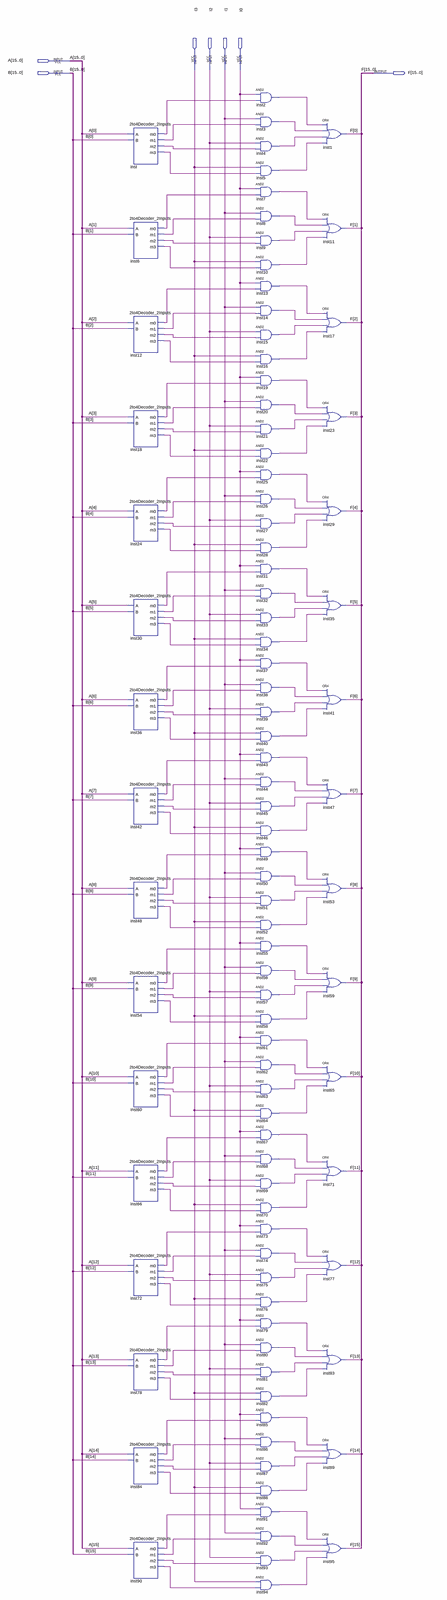
[diagram p0: schematic sheet, whole]
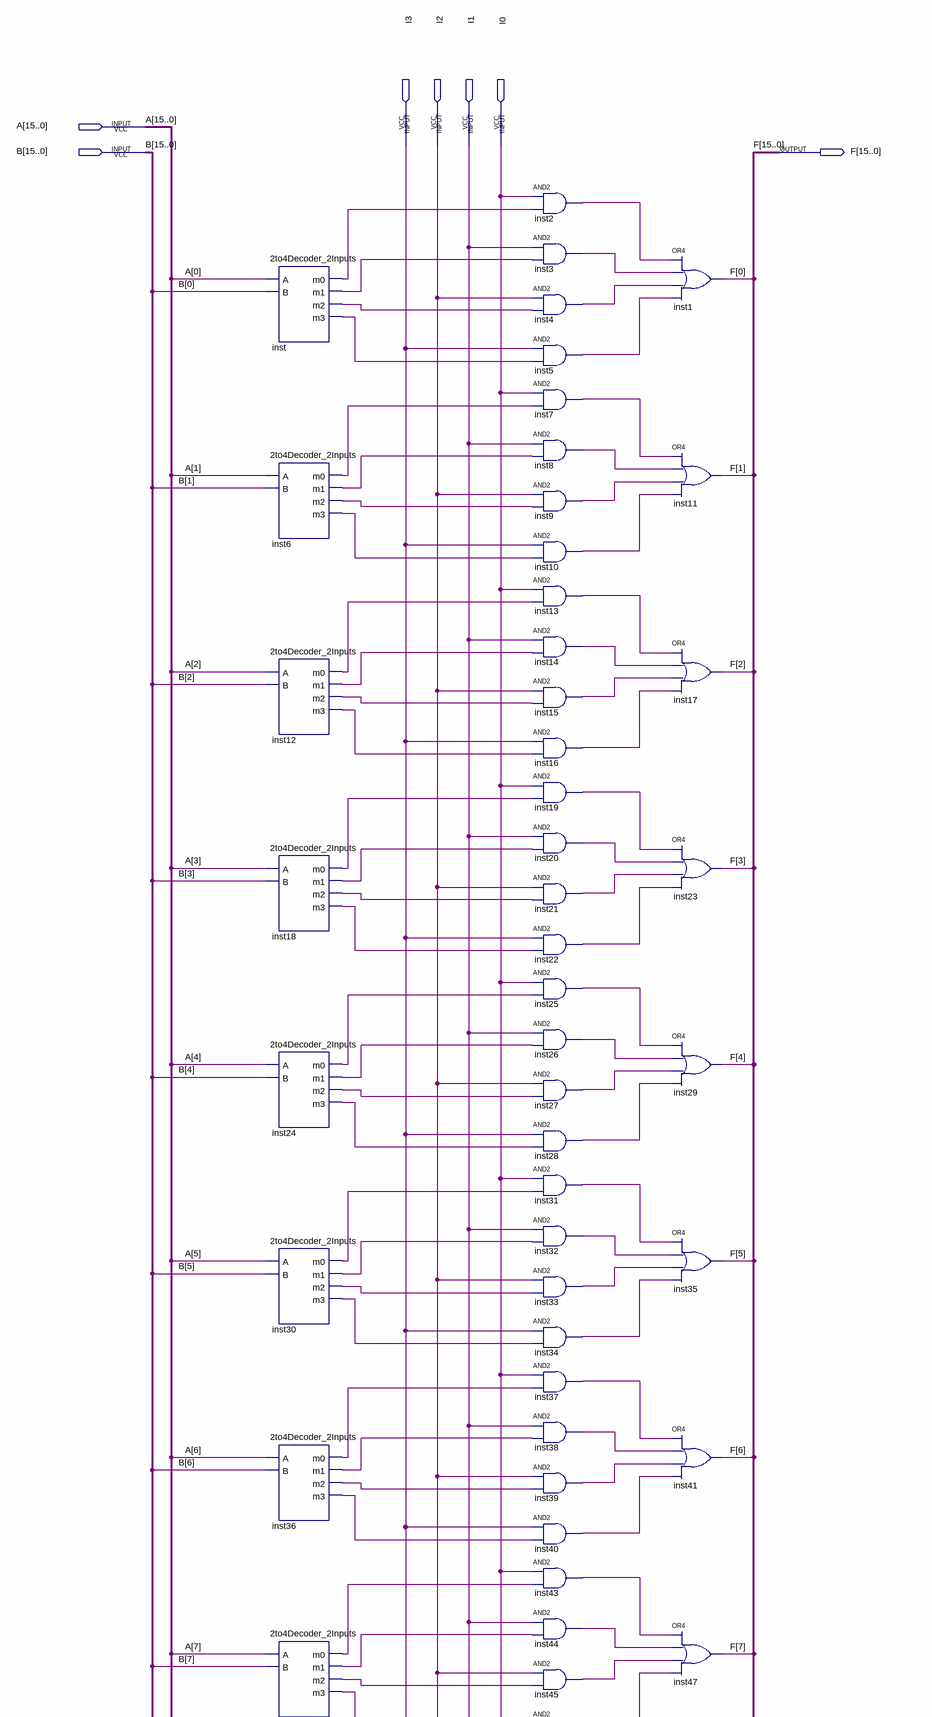
[diagram p1: schematic sheet, upper part]
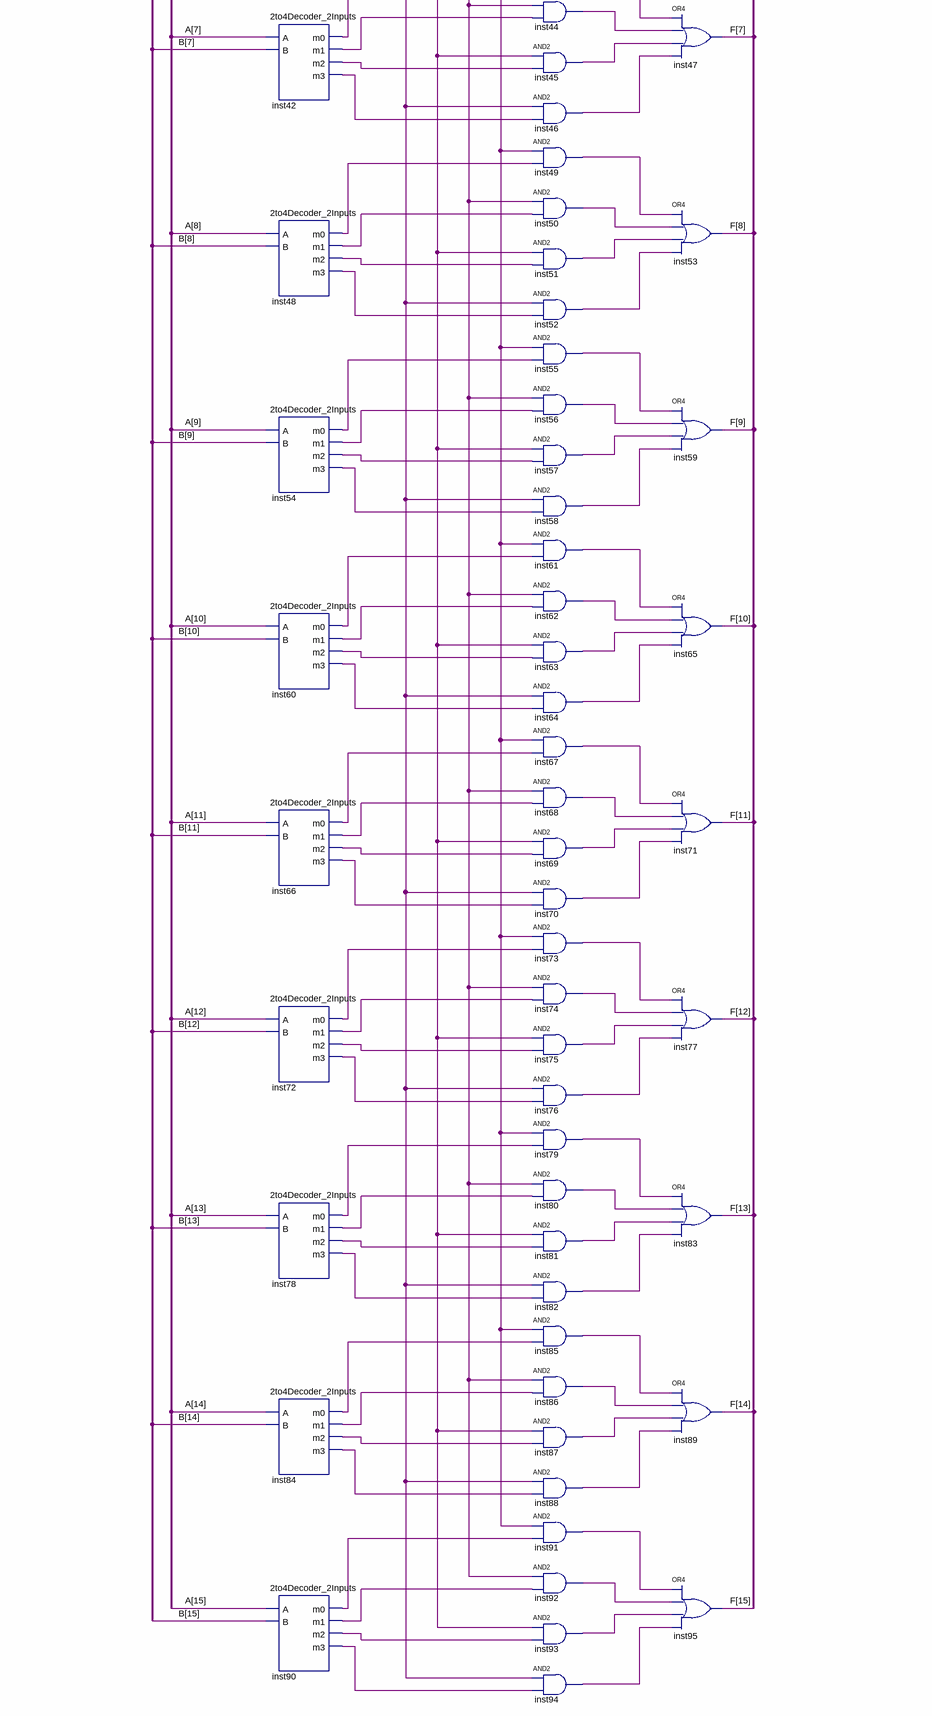
[diagram p2: schematic sheet, lower part]
// Quartus schematic 4by16LogicMux.bdf as structural Verilog: 96 symbols, 7 pins
module \4by16LogicMux  (
  input  [15:0] A,
  input  I3,
  input  I2,
  input  I1,
  input  I0,
  input  [15:0] B,
  output [15:0] F
);

  wire inst2_out, inst3_out, inst4_out, inst5_out, inst6_m0, inst6_m1, inst6_m2, inst6_m3, inst7_out,
       inst8_out, inst9_out, inst10_out, inst12_m0, inst12_m1, inst12_m2, inst12_m3, inst13_out, inst14_out,
       inst15_out, inst16_out, inst18_m0, inst18_m1, inst18_m2, inst18_m3, inst19_out, inst20_out,
       inst21_out, inst22_out, inst24_m0, inst24_m1, inst24_m2, inst24_m3, inst25_out, inst26_out,
       inst27_out, inst28_out, inst30_m0, inst30_m1, inst30_m2, inst30_m3, inst31_out, inst32_out,
       inst33_out, inst34_out, inst36_m0, inst36_m1, inst36_m2, inst36_m3, inst37_out, inst38_out,
       inst39_out, inst40_out, inst42_m0, inst42_m1, inst42_m2, inst42_m3, inst43_out, inst44_out,
       inst45_out, inst46_out, inst48_m0, inst48_m1, inst48_m2, inst48_m3, inst49_out, inst50_out,
       inst51_out, inst52_out, inst54_m0, inst54_m1, inst54_m2, inst54_m3, inst55_out, inst56_out,
       inst57_out, inst58_out, inst60_m0, inst60_m1, inst60_m2, inst60_m3, inst61_out, inst62_out,
       inst63_out, inst64_out, inst66_m0, inst66_m1, inst66_m2, inst66_m3, inst67_out, inst68_out,
       inst69_out, inst70_out, inst72_m0, inst72_m1, inst72_m2, inst72_m3, inst73_out, inst74_out,
       inst75_out, inst76_out, inst78_m0, inst78_m1, inst78_m2, inst78_m3, inst79_out, inst80_out,
       inst81_out, inst82_out, inst84_m0, inst84_m1, inst84_m2, inst84_m3, inst85_out, inst86_out,
       inst87_out, inst88_out, inst90_m0, inst90_m1, inst90_m2, inst90_m3, inst91_out, inst92_out,
       inst93_out, inst94_out, inst_m0, inst_m1, inst_m2, inst_m3;

  \2to4Decoder_2Inputs  inst (.A(A[0]), .B(B[0]), .m0(inst_m0), .m1(inst_m1), .m2(inst_m2), .m3(inst_m3));
  \2to4Decoder_2Inputs  inst6 (.A(A[1]), .B(B[1]), .m0(inst6_m0), .m1(inst6_m1), .m2(inst6_m2), .m3(inst6_m3));
  \2to4Decoder_2Inputs  inst12 (.A(A[2]), .B(B[2]), .m0(inst12_m0), .m1(inst12_m1), .m2(inst12_m2), .m3(inst12_m3));
  \2to4Decoder_2Inputs  inst18 (.A(A[3]), .B(B[3]), .m0(inst18_m0), .m1(inst18_m1), .m2(inst18_m2), .m3(inst18_m3));
  \2to4Decoder_2Inputs  inst24 (.A(A[4]), .B(B[4]), .m0(inst24_m0), .m1(inst24_m1), .m2(inst24_m2), .m3(inst24_m3));
  \2to4Decoder_2Inputs  inst30 (.A(A[5]), .B(B[5]), .m0(inst30_m0), .m1(inst30_m1), .m2(inst30_m2), .m3(inst30_m3));
  \2to4Decoder_2Inputs  inst36 (.A(A[6]), .B(B[6]), .m0(inst36_m0), .m1(inst36_m1), .m2(inst36_m2), .m3(inst36_m3));
  \2to4Decoder_2Inputs  inst42 (.A(A[7]), .B(B[7]), .m0(inst42_m0), .m1(inst42_m1), .m2(inst42_m2), .m3(inst42_m3));
  \2to4Decoder_2Inputs  inst48 (.A(A[8]), .B(B[8]), .m0(inst48_m0), .m1(inst48_m1), .m2(inst48_m2), .m3(inst48_m3));
  \2to4Decoder_2Inputs  inst54 (.A(A[9]), .B(B[9]), .m0(inst54_m0), .m1(inst54_m1), .m2(inst54_m2), .m3(inst54_m3));
  \2to4Decoder_2Inputs  inst60 (.A(A[10]), .B(B[10]), .m0(inst60_m0), .m1(inst60_m1), .m2(inst60_m2), .m3(inst60_m3));
  \2to4Decoder_2Inputs  inst66 (.A(A[11]), .B(B[11]), .m0(inst66_m0), .m1(inst66_m1), .m2(inst66_m2), .m3(inst66_m3));
  \2to4Decoder_2Inputs  inst72 (.A(A[12]), .B(B[12]), .m0(inst72_m0), .m1(inst72_m1), .m2(inst72_m2), .m3(inst72_m3));
  \2to4Decoder_2Inputs  inst78 (.A(A[13]), .B(B[13]), .m0(inst78_m0), .m1(inst78_m1), .m2(inst78_m2), .m3(inst78_m3));
  \2to4Decoder_2Inputs  inst84 (.A(A[14]), .B(B[14]), .m0(inst84_m0), .m1(inst84_m1), .m2(inst84_m2), .m3(inst84_m3));
  \2to4Decoder_2Inputs  inst90 (.A(A[15]), .B(B[15]), .m0(inst90_m0), .m1(inst90_m1), .m2(inst90_m2), .m3(inst90_m3));
  and inst2 (inst2_out, I0, inst_m0);
  and inst3 (inst3_out, I1, inst_m1);
  and inst4 (inst4_out, I2, inst_m2);
  and inst5 (inst5_out, I3, inst_m3);
  and inst7 (inst7_out, I0, inst6_m0);
  and inst8 (inst8_out, I1, inst6_m1);
  and inst9 (inst9_out, I2, inst6_m2);
  and inst10 (inst10_out, I3, inst6_m3);
  and inst13 (inst13_out, I0, inst12_m0);
  and inst14 (inst14_out, I1, inst12_m1);
  and inst15 (inst15_out, I2, inst12_m2);
  and inst16 (inst16_out, I3, inst12_m3);
  and inst19 (inst19_out, I0, inst18_m0);
  and inst20 (inst20_out, I1, inst18_m1);
  and inst21 (inst21_out, I2, inst18_m2);
  and inst22 (inst22_out, I3, inst18_m3);
  and inst25 (inst25_out, I0, inst24_m0);
  and inst26 (inst26_out, I1, inst24_m1);
  and inst27 (inst27_out, I2, inst24_m2);
  and inst28 (inst28_out, I3, inst24_m3);
  and inst31 (inst31_out, I0, inst30_m0);
  and inst32 (inst32_out, I1, inst30_m1);
  and inst33 (inst33_out, I2, inst30_m2);
  and inst34 (inst34_out, I3, inst30_m3);
  and inst37 (inst37_out, I0, inst36_m0);
  and inst38 (inst38_out, I1, inst36_m1);
  and inst39 (inst39_out, I2, inst36_m2);
  and inst40 (inst40_out, I3, inst36_m3);
  and inst43 (inst43_out, I0, inst42_m0);
  and inst44 (inst44_out, I1, inst42_m1);
  and inst45 (inst45_out, I2, inst42_m2);
  and inst46 (inst46_out, I3, inst42_m3);
  and inst49 (inst49_out, I0, inst48_m0);
  and inst50 (inst50_out, I1, inst48_m1);
  and inst51 (inst51_out, I2, inst48_m2);
  and inst52 (inst52_out, I3, inst48_m3);
  and inst55 (inst55_out, I0, inst54_m0);
  and inst56 (inst56_out, I1, inst54_m1);
  and inst57 (inst57_out, I2, inst54_m2);
  and inst58 (inst58_out, I3, inst54_m3);
  and inst61 (inst61_out, I0, inst60_m0);
  and inst62 (inst62_out, I1, inst60_m1);
  and inst63 (inst63_out, I2, inst60_m2);
  and inst64 (inst64_out, I3, inst60_m3);
  and inst67 (inst67_out, I0, inst66_m0);
  and inst68 (inst68_out, I1, inst66_m1);
  and inst69 (inst69_out, I2, inst66_m2);
  and inst70 (inst70_out, I3, inst66_m3);
  and inst73 (inst73_out, I0, inst72_m0);
  and inst74 (inst74_out, I1, inst72_m1);
  and inst75 (inst75_out, I2, inst72_m2);
  and inst76 (inst76_out, I3, inst72_m3);
  and inst79 (inst79_out, I0, inst78_m0);
  and inst80 (inst80_out, I1, inst78_m1);
  and inst81 (inst81_out, I2, inst78_m2);
  and inst82 (inst82_out, I3, inst78_m3);
  and inst85 (inst85_out, I0, inst84_m0);
  and inst86 (inst86_out, I1, inst84_m1);
  and inst87 (inst87_out, I2, inst84_m2);
  and inst88 (inst88_out, I3, inst84_m3);
  and inst91 (inst91_out, I0, inst90_m0);
  and inst92 (inst92_out, I1, inst90_m1);
  and inst93 (inst93_out, I2, inst90_m2);
  and inst94 (inst94_out, I3, inst90_m3);
  or inst1 (F[0], inst2_out, inst3_out, inst4_out, inst5_out);
  or inst11 (F[1], inst7_out, inst8_out, inst9_out, inst10_out);
  or inst17 (F[2], inst13_out, inst14_out, inst15_out, inst16_out);
  or inst23 (F[3], inst19_out, inst20_out, inst21_out, inst22_out);
  or inst29 (F[4], inst25_out, inst26_out, inst27_out, inst28_out);
  or inst35 (F[5], inst31_out, inst32_out, inst33_out, inst34_out);
  or inst41 (F[6], inst37_out, inst38_out, inst39_out, inst40_out);
  or inst47 (F[7], inst43_out, inst44_out, inst45_out, inst46_out);
  or inst53 (F[8], inst49_out, inst50_out, inst51_out, inst52_out);
  or inst59 (F[9], inst55_out, inst56_out, inst57_out, inst58_out);
  or inst65 (F[10], inst61_out, inst62_out, inst63_out, inst64_out);
  or inst71 (F[11], inst67_out, inst68_out, inst69_out, inst70_out);
  or inst77 (F[12], inst73_out, inst74_out, inst75_out, inst76_out);
  or inst83 (F[13], inst79_out, inst80_out, inst81_out, inst82_out);
  or inst89 (F[14], inst85_out, inst86_out, inst87_out, inst88_out);
  or inst95 (F[15], inst91_out, inst92_out, inst93_out, inst94_out);
endmodule
